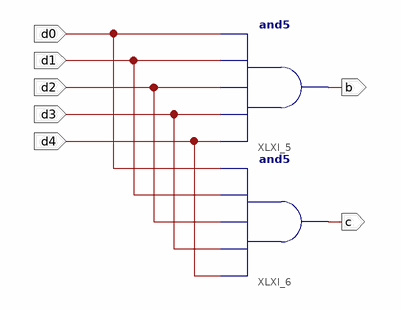
[diagram p0: schematic sheet 1]
// Xilinx ISE schematic bcSSD.sch (xc9500xl) as structural Verilog: 2 symbols, 7 ports
module bcSSD (
  input  d0,
  input  d1,
  input  d2,
  input  d3,
  input  d4,
  output b,
  output c
);

  and XLXI_5 (b, d4, d3, d2, d1, d0);
  and XLXI_6 (c, d4, d3, d2, d1, d0);
endmodule
